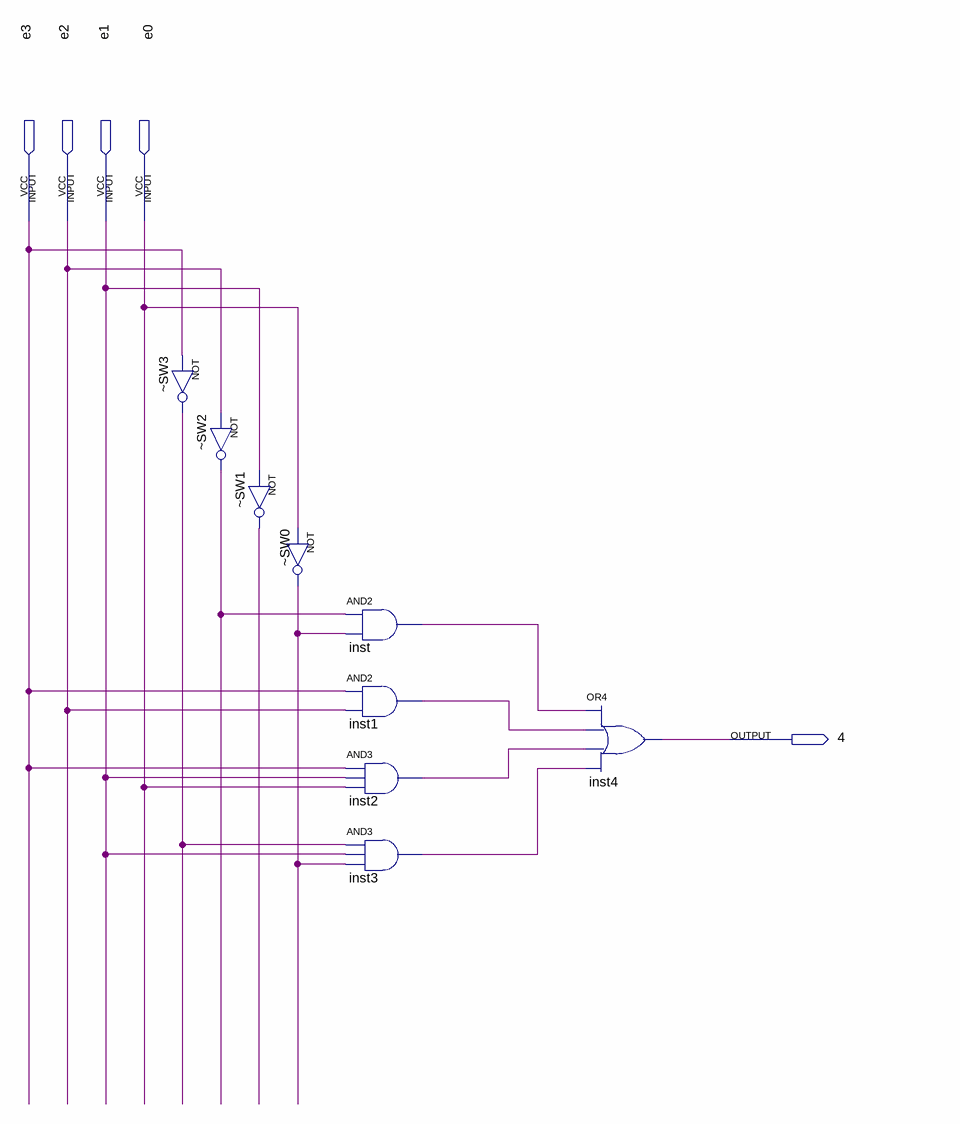
[diagram p0: schematic sheet]
// Quartus schematic 4.bdf as structural Verilog: 9 symbols, 5 pins
module \4  (
  input  e3,
  input  e2,
  input  e1,
  input  e0,
  output \4 
);

  wire _SW0_out, _SW1_out, _SW2_out, _SW3_out, inst1_out, inst2_out, inst3_out, inst_out;

  not \u_~SW3  (_SW3_out, e3);
  not \u_~SW2  (_SW2_out, e2);
  not \u_~SW1  (_SW1_out, e1);
  not \u_~SW0  (_SW0_out, e0);
  and inst (inst_out, _SW2_out, _SW0_out);
  and inst1 (inst1_out, e3, e2);
  and inst2 (inst2_out, e3, e1, e0);
  and inst3 (inst3_out, _SW3_out, e1, _SW0_out);
  or inst4 (\4 , inst_out, inst1_out, inst2_out, inst3_out);
endmodule
